# Altium schematic sheet Battery_Power_Module.SchDoc: Battery Power Module
size A4
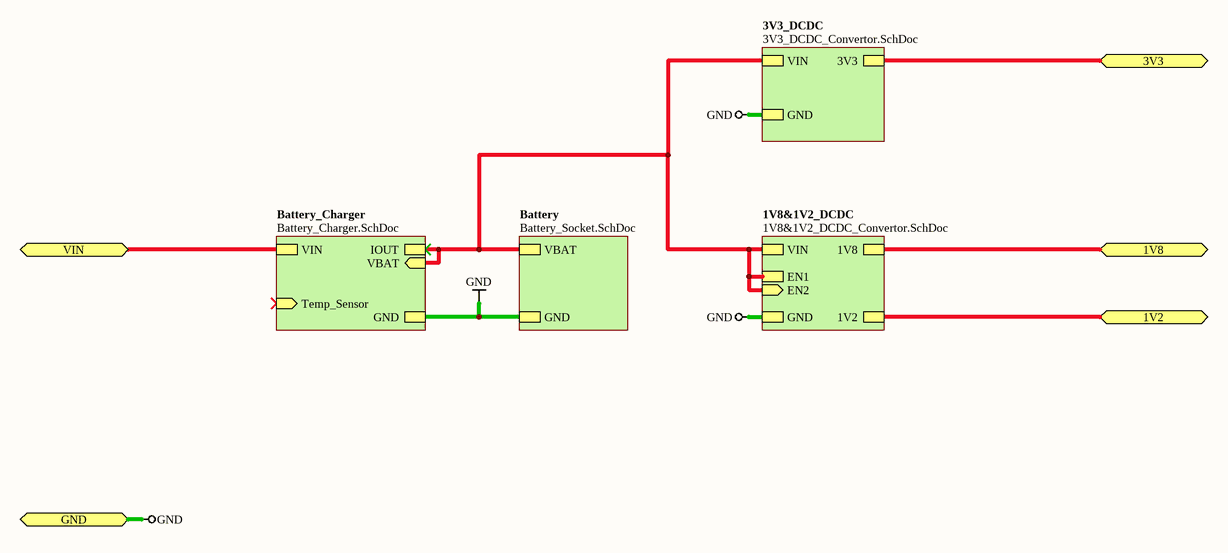
[diagram p0: Battery_Power_Module.SchDoc]

## Sub-sheets
1V8&1V2_DCDC = 1V8&1V2_DCDC_Convertor.SchDoc: VIN, EN1, EN2 (in), GND, 1V8, 1V2
3V3_DCDC = 3V3_DCDC_Convertor.SchDoc: VIN, GND, 3V3
Battery = Battery_Socket.SchDoc: VBAT, GND
Battery_Charger = Battery_Charger.SchDoc: VIN, GND, Temp_Sensor (in), VBAT (in), IOUT

## Ports
1V2, 1V8, 3V3, GND, VIN

## Nets
GND: port GND, sheet 3V3_DCDC/GND, sheet 1V8&1V2_DCDC/GND, sheet Battery/GND, sheet Battery_Charger/GND
1V2: port 1V2, sheet 1V8&1V2_DCDC/1V2
1V8: port 1V8, sheet 1V8&1V2_DCDC/1V8
3V3: port 3V3, sheet 3V3_DCDC/3V3
VIN: port VIN, sheet Battery_Charger/VIN
(unnamed): sheet 3V3_DCDC/VIN, sheet 1V8&1V2_DCDC/VIN, sheet 1V8&1V2_DCDC/EN1, sheet 1V8&1V2_DCDC/EN2, sheet Battery/VBAT, sheet Battery_Charger/VBAT, sheet Battery_Charger/IOUT

## Notes on the sheet
- Sheet Title
- Project Title
- Size:
- Date:
- A4
- Item:
- Time:
- Revision:
- Sheet
- of
- File: